# Altium schematic sheet Sheet2.SchDoc
size A; SheetNumber: 1; SheetTotal: 1
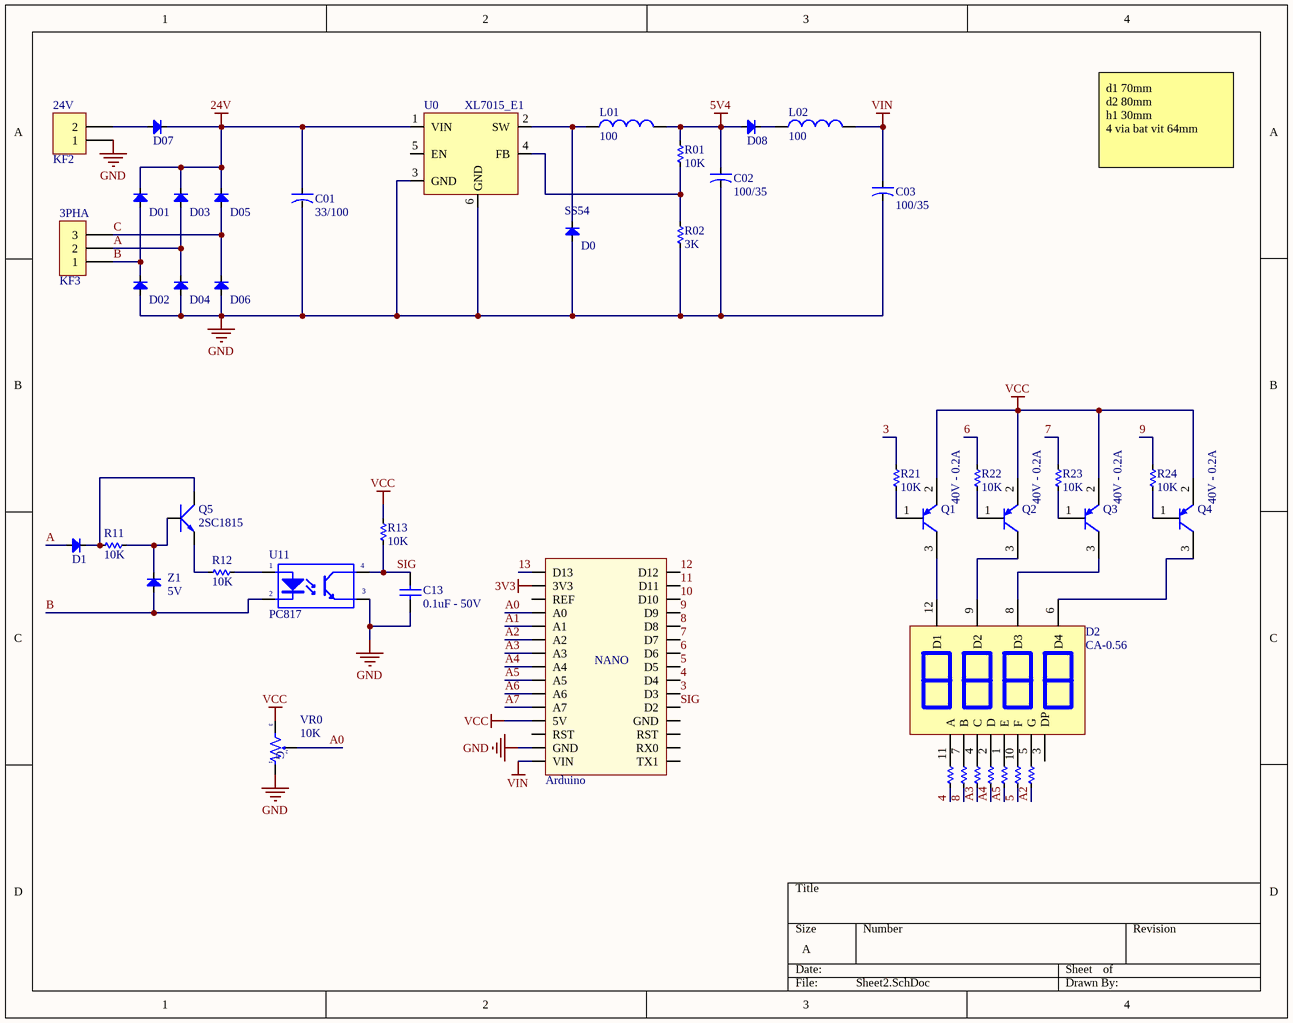
[diagram p0: Sheet2.SchDoc]

## Parts
3PHA  KF3  [KF3-3.5]
24V  KF2  [KF2-3.5]
Arduino  Arduino Nano  [Arduino Nano]  (value not drawn)
C01  33/100  [CA-ALU-6.3]
C02  100/35  [CA-ALU-6.3]
C03  100/35  [CA-ALU-6.3]
C13  0.1uF - 50V  [CAPC_0805_N]
D0  SS54  [DIO-SMD-106]
D01  Diode SMD  [DIO-SMD-106]  (value not drawn)
D1  Diode SMD  [DIO-SMD-106]  (value not drawn)
D02  Diode SMD  [DIO-SMD-106]  (value not drawn)
D2  CA-0.56  [LED7SEG-4-0.56]
D03  Diode SMD  [DIO-SMD-106]  (value not drawn)
D04  Diode SMD  [DIO-SMD-106]  (value not drawn)
D05  Diode SMD  [DIO-SMD-106]  (value not drawn)
D06  Diode SMD  [DIO-SMD-106]  (value not drawn)
D07  Diode SMD  [DIO-SMD-106]  (value not drawn)
D08  Diode SMD  [DIO-SMD-106]  (value not drawn)
L01  100  [SMD_IND_7.8x7mm]
L02  100  [SMD_IND_7.8x7mm]
Q1  40V - 0.2A  [SOT-23-132]
Q2  40V - 0.2A  [SOT-23-132]
Q3  40V - 0.2A  [SOT-23-132]
Q4  40V - 0.2A  [SOT-23-132]
Q5  2SC1815  [TO92-123]
R1  1K  [RES-SMD-0805]  (value not drawn)
R01  10K  [RES-SMD-0805]
R2  1K  [RES-SMD-0805]  (value not drawn)
R02  3K  [RES-SMD-0805]
R3  1K  [RES-SMD-0805]  (value not drawn)
R4  1K  [RES-SMD-0805]  (value not drawn)
R5  1K  [RES-SMD-0805]  (value not drawn)
R6  1K  [RES-SMD-0805]  (value not drawn)
R7  1K  [RES-SMD-0805]  (value not drawn)
R11  10K  [RES-SMD-0805]
R12  10K  [RES-SMD-0805]
R13  10K  [RES-SMD-0805]
R21  10K  [RES-SMD-0805]
R22  10K  [RES-SMD-0805]
R23  10K  [RES-SMD-0805]
R24  10K  [RES-SMD-0805]
U0  XL7015_E1  [TO252-5L]
U11  PC817  [DIP4]
VR0  10K  [VR-S3]
Z1  5V  [DIO-SMD-106]

## Nets
3V3: Arduino.3V3
5V4: C02.1 D08.1(A) L01.2 R01.2
24V: C01.1 D01.2(K) D03.2(K) D05.2(K) D07.2(K) U0.1(VIN)
GND: 24V.1 Arduino.GND C01.2 C02.2 C03.2 C13.1 D0.1(A) D02.1(A) D04.1(A) D06.1(A) R02.1 U0.3(GND) U0.6(GND) U11.3(E) VR0.1
VCC: Arduino.5V Q1.2(E) Q2.2(E) Q3.2(E) Q4.2(E) R13.1 VR0.3
VIN: Arduino.VIN C03.1 L02.2
3: Arduino.D3 R21.1
4: Arduino.D4 R1.1
5: Arduino.D5 R6.1
6: Arduino.D6 R22.1
7: Arduino.D7 R23.1
8: Arduino.D8 R2.1
9: Arduino.D9 R24.1
10: Arduino.D10
11: Arduino.D11
12: Arduino.D12
13: Arduino.D13
A: 3PHA.2 D1.1(A) D03.1(A) D04.2(K)
A0: Arduino.A0 VR0.2
A1: Arduino.A1
A2: Arduino.A2 R7.1
A3: Arduino.A3 R3.1
A4: Arduino.A4 R4.1
A5: Arduino.A5 R5.1
A6: Arduino.A6
A7: Arduino.A7
B: 3PHA.1 D01.1(A) D02.2(K) U11.2(K) Z1.1(A)
C: 3PHA.3 D05.1(A) D06.2(K)
SIG: Arduino.D2 C13.2 R13.2 U11.4(C)
Net24V_2: 24V.2 D07.1(A)
NetD0_2: D0.2(K) L01.1 U0.2(SW)
NetD1_2: D1.2(K) Q5.2(C) R11.2
NetD2_1: D2.1(E) R5.2
NetD2_2: D2.2(D) R4.2
NetD2_4: D2.4(C) R3.2
NetD2_5: D2.5(G) R7.2
NetD2_6: D2.6(D4) Q4.3(C)
NetD2_7: D2.7(B) R2.2
NetD2_8: D2.8(D3) Q3.3(C)
NetD2_9: D2.9(D2) Q2.3(C)
NetD2_10: D2.10(F) R6.2
NetD2_11: D2.11(A) R1.2
NetD2_12: D2.12(D1) Q1.3(C)
NetD08_2: D08.2(K) L02.1
NetQ1_1: Q1.1 R21.2
NetQ2_1: Q2.1 R22.2
NetQ3_1: Q3.1 R23.2
NetQ4_1: Q4.1 R24.2
NetQ5_1: Q5.1(E) R12.2
NetQ5_3: Q5.3(B) R11.1 Z1.2(K)
NetR01_1: R01.1 R02.2 U0.4(FB)
NetR12_1: R12.1 U11.1(A)

Not connected (* = marked no-connect by the designer): Arduino REF RST RX0 TX1; D2 3(DP); U0 5(EN)

## Notes on the sheet
- d1 70mm
  d2 80mm
  h1 30mm
  4 via bat vit 64mm
- (in symbol Arduino Nano) NANO
- (in symbol VR-S) G

## Library data of the parts
3PHA = KF3: Manufacturer: Würth Elektronik eiSos GmbH; partNo: 691103110003; ComponentLink1 Description: Manufacturer; ComponentLink2 Description: Datasheet; NoPins: 3; Created Date: 29 October 2013; ComponentLink1URL: http://www.we-online.com; ComponentLink2URL: http://katalog.we-online.de/em/datasheet/6911031100xx.pdf; Created by: Karrer Zheng
24V = KF2: Manufacturer: Würth Elektronik eiSos GmbH; partNo: 691103110002; ComponentLink1 Description: Manufacturer; ComponentLink2 Description: Datasheet; NoPins: 2; Created Date: 29 October 2013; ComponentLink1URL: http://www.we-online.com; ComponentLink2URL: http://katalog.we-online.de/em/datasheet/6911031100xx.pdf; Created by: Karrer Zheng
Arduino = Arduino Nano: Value: Cau 1A
C01 C02 C03 = CN-ALU-DIP: Capacitor (Semiconductor SIM Model); Value: 104; LatestRevisionDate: 17-Jul-2002; LatestRevisionNote: Re-released for DXP Platform.; PackageReference: C1206; Publisher: Altium Limited
C13 = CC0805JRX7R9BB104: 50V 100nF X7R ±5% 0805 Multilayer Ceramic Capacitors MLCC - SMD/SMT ROHS; Partnumber: CC0805JRX7R9BB104; Value: 0.1uF - 50V; Creator: Datnd; Category: Capacitor; Mounting type: SMD; Supplier: LCSC; Detailed Value: 0.1uF - 50V
D0 D01 D1 D02 D03 D04 D05 D06 D07 D08 Z1 = Diode SMD: Default Diode; Code - JEDEC: DO-214-AB; Value: 1N5007; Published: 8-Jun-2000; Revision: July-2002: Re-released for DXP Platform.; Publisher: Altium Limited
D2 = MH005139: LED 7 0.56 4 số Anot (Xanh Dương); Link sale: #https://banlinhkien.vn/goods-5139-led-7-0-56-4-so-anot-xanh-duong-.html#; Partnumber: MH005139; Value: CA-0.56; Creator: Tunn; Category: LED; Mounting type: TH; Supplier: MINH HÀ; Detailed Value: CA-0.56
L01 L02 = CMLF0705-390KTT: 1.4A 39uH Unshielded inductor ±10% SMD,7.8x7mm Power Inductors ROHS; Manufacture: Cybermax; Partnumber: CMLF0705-390KTT; Value: 39uH; Creator: Datnd; Category: Inductor; Mounting type: SMD; Supplier: LCSC; Detailed Value: 39uH
Q1-Q4 = MMBT3906: Bipolar (BJT) Transistor PNP 40V 200mA 250MHz 300mW Surface Mount SOT-23-3; Manufacture: Diodes Incorporated; Link sale: #https://www.digikey.com/products/en?keywords=MMBT3906#; Partnumber: MMBT3906; Datasheet: #https://media.digikey.com/pdf/Data%20Sheets/Diodes%20PDFs/MMBT3906.pdf#; Value: 40V - 0.2A; Creator: Tunn; Category: Transistor; Mounting type: SMD; Supplier: Digikey; Detailed Value: PNP 40V 200mA
Q5 = 2SC1815: NPN 600mW, ECB; Value: C1815
R1 R01 R2 R02-R7 R11-R13 R21-R24 = Res-SMD: Resistor; Manufacturer: Generic Components; Class: Passive; Published: 08/06/2000; Publisher: Altium Hobart Technology Centre
U11 = PC817: Single Opto; Value: PC817
VR0 = VR-S: Var Resistor; Value: Volume 50k